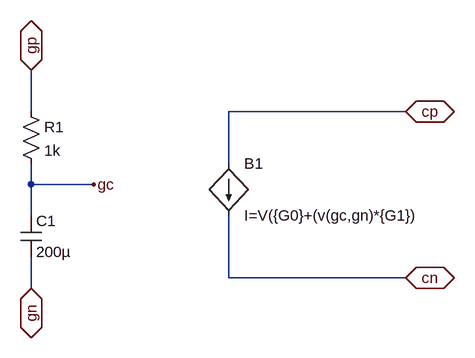
[diagram p0: schematic capteurgraphite.asc]
capteurgraphite.asc, the LTspice schematic file:
Version 4
SHEET 1 880 680
WIRE -320 32 -320 -32
WIRE 256 32 -16 32
WIRE -16 112 -16 32
WIRE -320 144 -320 112
WIRE -224 144 -320 144
WIRE -320 192 -320 144
WIRE -16 288 -16 192
WIRE 256 288 -16 288
WIRE -320 304 -320 256
FLAG 256 32 cp
IOPIN 256 32 BiDir
FLAG 256 288 cn
IOPIN 256 288 BiDir
FLAG -320 304 gn
IOPIN -320 304 BiDir
FLAG -320 -32 gp
IOPIN -320 -32 BiDir
FLAG -224 144 gc
SYMBOL bi -16 112 R0
SYMATTR InstName B1
SYMATTR Value I=V({G0}+(v(gc,gn)*{G1})
SYMBOL res -336 16 R0
SYMATTR InstName R1
SYMATTR Value 1k
SYMBOL cap -336 192 R0
SYMATTR InstName C1
SYMATTR Value 200µ

The netlist it stands for:
* capteurgraphite.asc
B1 cp cn I=V({G0}+(v(gc,gn)*{G1})
R1 gp gc 1k
C1 gc gn 200µ
.backanno
.end